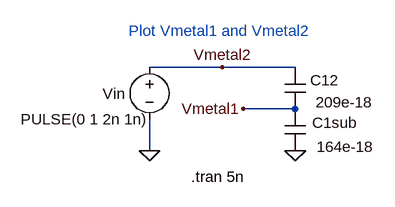
[diagram p0: schematic Fig3_10.asc]
Fig3_10.asc, the LTspice schematic file:
Version 4
SHEET 1 1056 688
WIRE -160 336 -160 288
WIRE -48 208 -160 208
WIRE 64 208 -48 208
WIRE 64 272 -16 272
FLAG -160 336 0
FLAG 64 336 0
FLAG -48 208 Vmetal2
FLAG -16 272 Vmetal1
SYMBOL voltage -160 192 R0
WINDOW 0 -72 57 Left 0
WINDOW 3 -198 96 Left 0
WINDOW 123 0 0 Left 0
WINDOW 39 0 0 Left 0
SYMATTR InstName Vin
SYMATTR Value PULSE(0 1 2n 1n)
SYMBOL cap 48 272 R0
WINDOW 0 42 21 Left 0
WINDOW 3 49 58 Left 0
SYMATTR InstName C1sub
SYMATTR Value 164e-18
SYMBOL cap 48 208 R0
WINDOW 0 39 20 Left 0
WINDOW 3 48 54 Left 0
SYMATTR InstName C12
SYMATTR Value 209e-18
TEXT -96 376 Left 0 !.tran 5n
TEXT -192 152 Left 0 ;Plot Vmetal1 and Vmetal2

The netlist it stands for:
* Fig3_10.asc
Vin Vmetal2 0 PULSE(0 1 2n 1n)
C1sub Vmetal1 0 164e-18
C12 Vmetal2 Vmetal1 209e-18
.tran 5n
* Plot Vmetal1 and Vmetal2
.backanno
.end